# Altium schematic sheet 板球系统51控制板.SchDoc
size A3
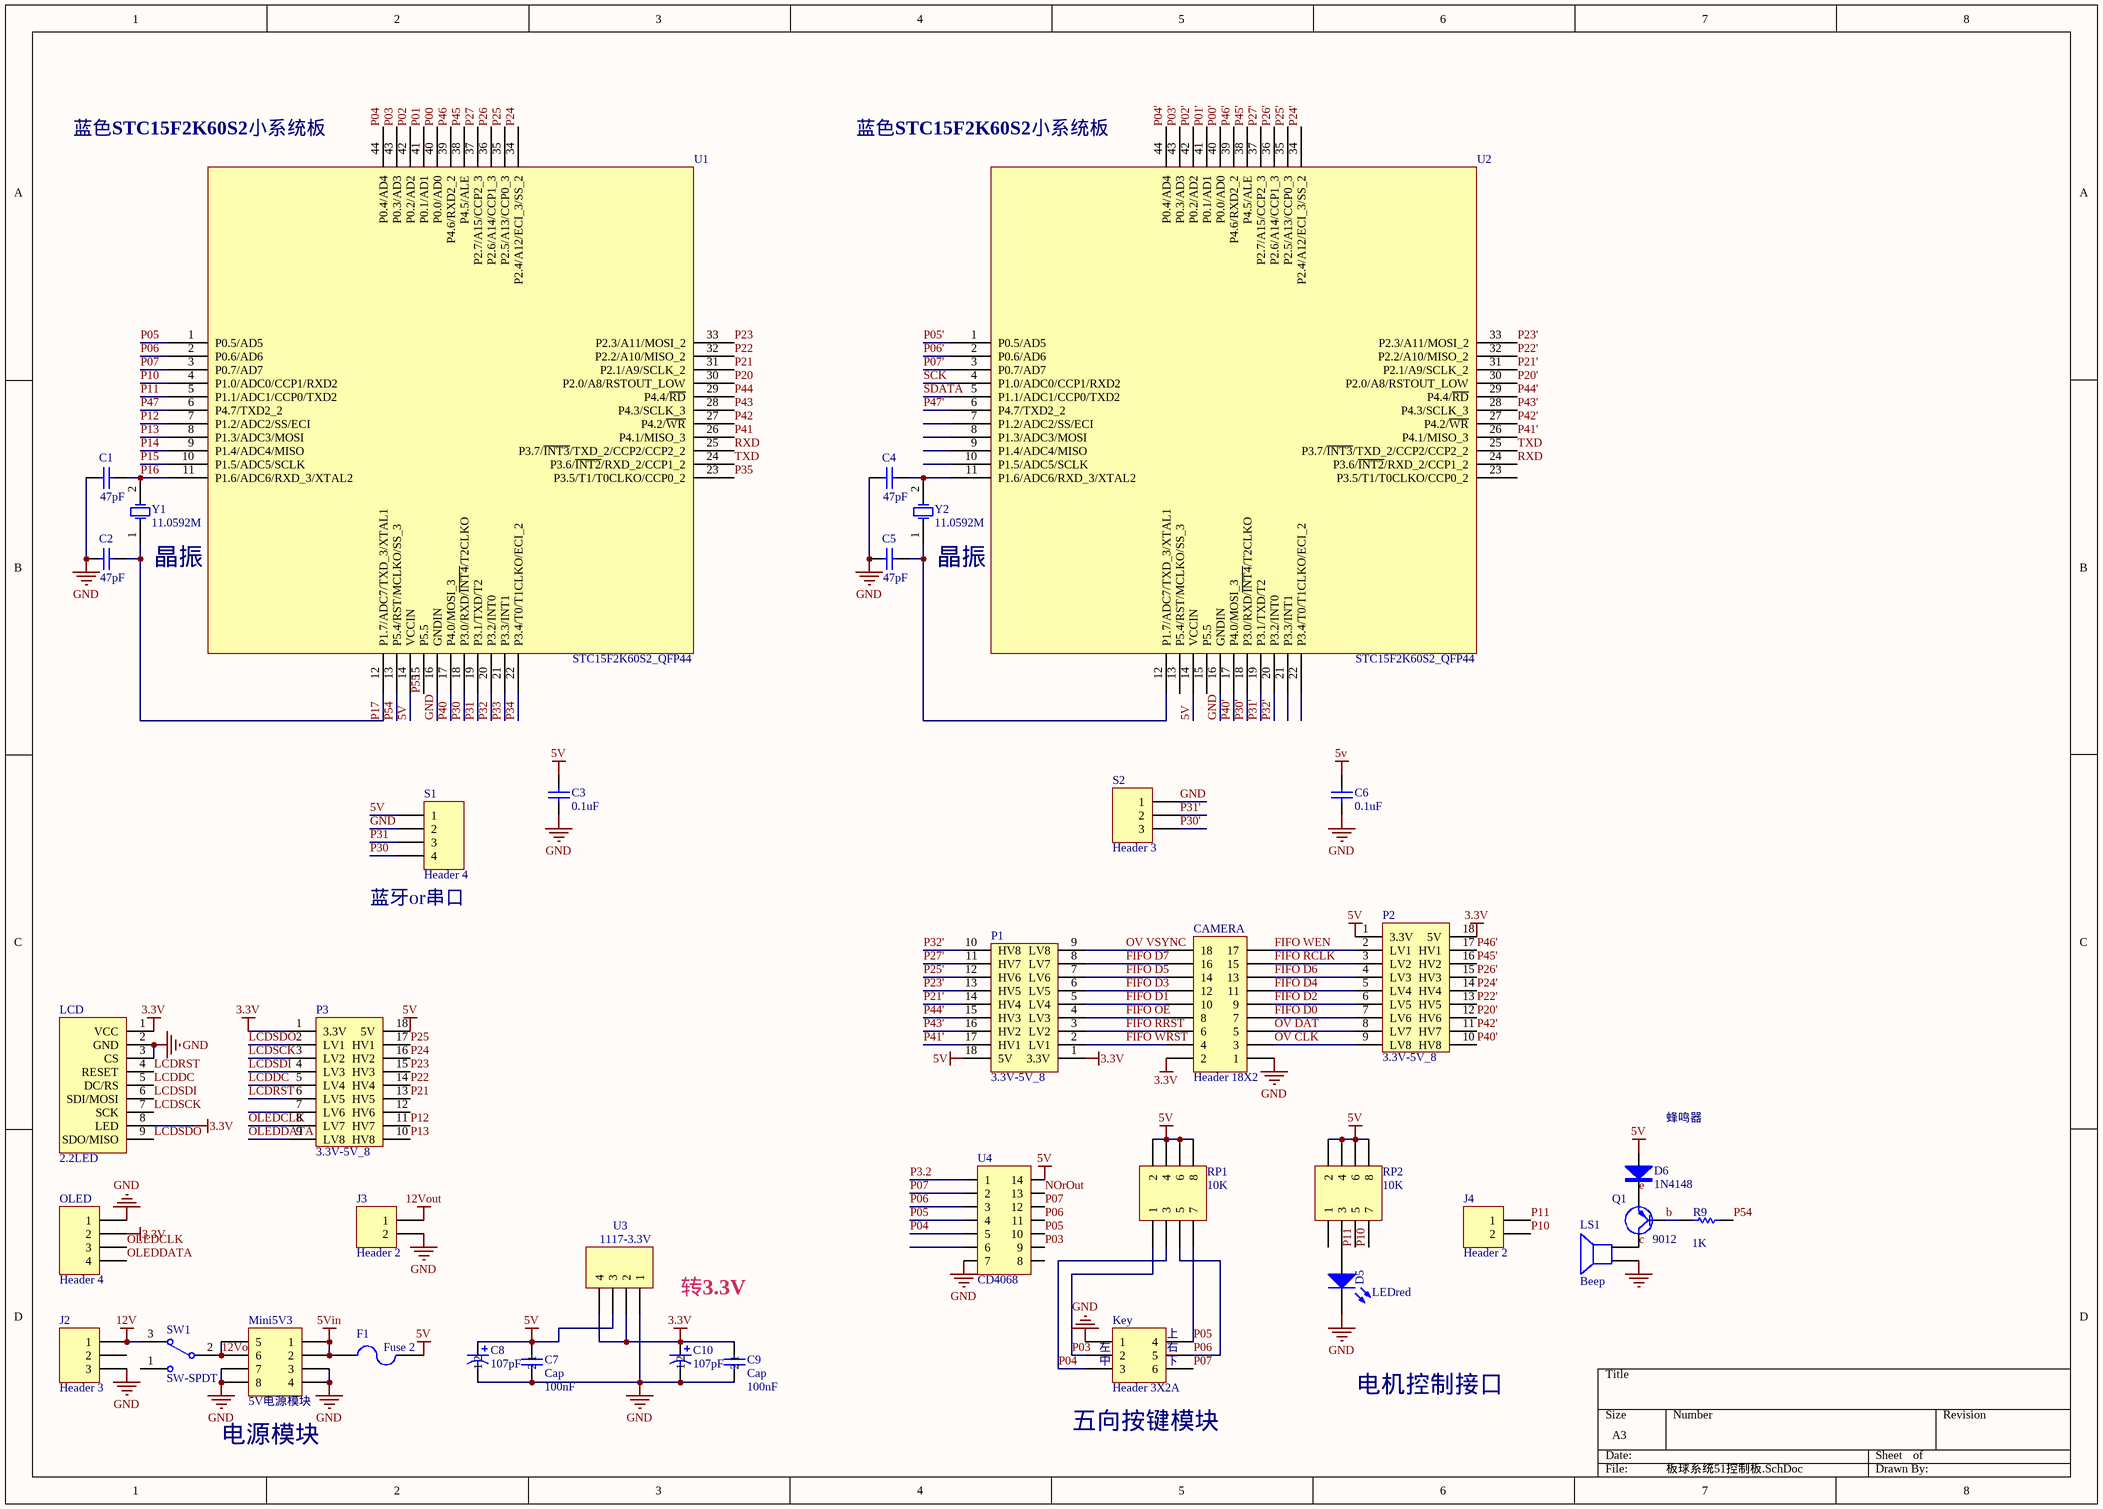
[diagram p0: 板球系统51控制板.SchDoc]

## Parts
C1  47pF  [0805]
C2  47pF  [0805]
C3  0.1uF  [0805]
C4  47pF  [0805]
C5  47pF  [0805]
C6  0.1uF  [0805]
C7  Cap  value 100nF  [0805_C]
C8  107pF  [1206]
C9  Cap  value 100nF  [0805_C]
C10  107pF  [1206]
CAMERA  Header 18X2  [HDR2X9H]
D5  LEDred  [0805_LED_S4]
D6  1N4148  [SOD-123]
F1  Fuse 2  [0805]
J2  Header 3  [Power]
J3  Header 2  [HDR1X2]
J4  Header 2  [HDR1X2]
Key  Header 3X2A  [Key5D]
LCD  2.2LED  [2.2LCD]
LS1  Beep  [BUFFER-12]
Mini5V3  5V电源模块  [Mini5Vpower]
OLED  Header 4  [sip4]
P1  3.3V-5V_8  [3.3V-5V_8]
P2  3.3V-5V_8  [3.3V-5V_8]
P3  3.3V-5V_8  [3.3V-5V_8]
Q1  9012  [SOT23]
R9  value 1K  [0805_R]  (hidden comment: Res1)
RP1  10K  [R0603_8P4R]
RP2  10K  [R0603_8P4R]
S1  Header 4  [HDR1X4]
S2  Header 3  [HDR1X3]
SW1  SW-SPDT  [switch2]
U1  STC15F2K60S2_QFP44  [LQFP44G]
U2  STC15F2K60S2_QFP44  [LQFP44G]
U3  1117-3.3V  [SOT223]
U4  CD4068  [sop14N]
Y1  11.0592M  [XTAL1]
Y2  11.0592M  [XTAL1]

## Nets
3.3V: C9.2 C10.1 CAMERA.2 LCD.1(VCC) LCD.8(LED) OLED.2 P1.1(3.3V) P2.18(5V) P3.1(3.3V) U3.2 U3.4
5V: C3.2 C6.2 C7.2 C8.1 D6.1(A) F1.2 P1.18(5V) P2.1(3.3V) P3.18(5V) RP1.2 RP1.4 RP1.6 RP1.8 RP2.2 RP2.4 RP2.6 RP2.8 S1.1 U1.14(VCCIN) U2.14(VCCIN) U3.3 U4.14
5Vin: F1.1 Mini5V3.1 Mini5V3.2
12V: J2.1 SW1.3
12Vout: J3.1 Mini5V3.5 Mini5V3.6 SW1.2
GND: C1.1 C2.1 C3.1 C4.1 C5.1 C6.1 C7.1 C8.2 C9.1 C10.2 CAMERA.1 D5.2(K) J2.3 J3.2 Key.1 LCD.2(GND) LCD.3(CS) LS1.2 Mini5V3.3 Mini5V3.4 Mini5V3.7 Mini5V3.8 OLED.1 S1.2 S2.1 U1.16(GNDIN) U2.16(GNDIN) U3.1 U4.7
b: Q1.1(B) R9.1
c: LS1.1 Q1.3(C)
e: D6.2(K) Q1.2(E)
FIFO D0: CAMERA.7 P2.7(LV6)
FIFO D1: CAMERA.10 P1.5(LV4)
FIFO D2: CAMERA.9 P2.6(LV5)
FIFO D3: CAMERA.12 P1.6(LV5)
FIFO D4: CAMERA.11 P2.5(LV4)
FIFO D5: CAMERA.14 P1.7(LV6)
FIFO D6: CAMERA.13 P2.4(LV3)
FIFO D7: CAMERA.16 P1.8(LV7)
FIFO OE: CAMERA.8 P1.4(LV3)
FIFO RCLK: CAMERA.15 P2.3(LV2)
FIFO RRST: CAMERA.6 P1.3(LV2)
FIFO WEN: CAMERA.17 P2.2(LV1)
FIFO WRST: CAMERA.4 P1.2(LV1)
LCDDC: LCD.5(DC/RS) P3.5(LV4)
LCDRST: LCD.4(RESET) P3.6(LV5)
LCDSCK: LCD.7(SCK) P3.3(LV2)
LCDSDI: LCD.6(SDI/MOSI) P3.4(LV3)
LCDSDO: LCD.9(SDO/MISO) P3.2(LV1)
NOrOut: U4.13
OLEDCLK: OLED.3 P3.8(LV7)
OLEDDATA: OLED.4 P3.9(LV8)
OV CLK: CAMERA.3 P2.9(LV8)
OV DAT: CAMERA.5 P2.8(LV7)
OV VSYNC: CAMERA.18 P1.9(LV8)
P00: U1.40(P0.0/AD0)
P00': U2.40(P0.0/AD0)
P01: U1.41(P0.1/AD1)
P01': U2.41(P0.1/AD1)
P02: U1.42(P0.2/AD2)
P02': U2.42(P0.2/AD2)
P03: Key.2 RP1.1 U1.43(P0.3/AD3) U4.9
P03': U2.43(P0.3/AD3)
P3.2: U4.1
P04: Key.3 RP1.3 U1.44(P0.4/AD4) U4.5
P04': U2.44(P0.4/AD4)
P05: Key.4 RP1.7 U1.1(P0.5/AD5) U4.4 U4.10
P05': U2.1(P0.5/AD5)
P06: Key.5 RP1.5 U1.2(P0.6/AD6) U4.3 U4.11
P06': U2.2(P0.6/AD6)
P07: Key.6 U1.3(P0.7/AD7) U4.2 U4.12
P07': U2.3(P0.7/AD7)
P10: J4.2 RP2.7 U1.4(P1.0/ADC0/CCP1/RXD2)
P11: J4.1 RP2.5 U1.5(P1.1/ADC1/CCP0/TXD2)
P12: P3.11(HV7) U1.7(P1.2/ADC2/SS/ECI)
P13: P3.10(HV8) U1.8(P1.3/ADC3/MOSI)
P14: U1.9(P1.4/ADC4/MISO)
P15: U1.10(P1.5/ADC5/SCLK)
P16: C1.2 U1.11(P1.6/ADC6/RXD_3/XTAL2) Y1.2(OSC2)
P17: C2.2 U1.12(P1.7/ADC7/TXD_3/XTAL1) Y1.1(OSC1)
P20: U1.30(P2.0/A8/RSTOUT_LOW)
P20': P2.12(HV6) U2.30(P2.0/A8/RSTOUT_LOW)
P21: P3.13(HV5) U1.31(P2.1/A9/SCLK_2)
P21': P1.14(HV4) U2.31(P2.1/A9/SCLK_2)
P22: P3.14(HV4) U1.32(P2.2/A10/MISO_2)
P22': P2.13(HV5) U2.32(P2.2/A10/MISO_2)
P23: P3.15(HV3) U1.33(P2.3/A11/MOSI_2)
P23': P1.13(HV5) U2.33(P2.3/A11/MOSI_2)
P24: P3.16(HV2) U1.34(P2.4/A12/ECI_3/SS_2)
P24': P2.14(HV4) U2.34(P2.4/A12/ECI_3/SS_2)
P25: P3.17(HV1) U1.35(P2.5/A13/CCP0_3)
P25': P1.12(HV6) U2.35(P2.5/A13/CCP0_3)
P26: U1.36(P2.6/A14/CCP1_3)
P26': P2.15(HV3) U2.36(P2.6/A14/CCP1_3)
P27: U1.37(P2.7/A15/CCP2_3)
P27': P1.11(HV7) U2.37(P2.7/A15/CCP2_3)
P30: S1.4 U1.18(P3.0/RXD/~{INT4}/T2CLKO)
P30': S2.3 U2.18(P3.0/RXD/~{INT4}/T2CLKO)
P31: S1.3 U1.19(P3.1/TXD/T2)
P31': S2.2 U2.19(P3.1/TXD/T2)
P32: U1.20(P3.2/INT0)
P32': P1.10(HV8) U2.20(P3.2/INT0)
P33: U1.21(P3.3/INT1)
P34: U1.22(P3.4/T0/T1CLKO/ECI_2)
P35: U1.23(P3.5/T1/T0CLKO/CCP0_2)
P40: U1.17(P4.0/MOSI_3)
P40': P2.10(HV8) U2.17(P4.0/MOSI_3)
P41: U1.26(P4.1/MISO_3)
P41': P1.17(HV1) U2.26(P4.1/MISO_3)
P42: U1.27(P4.2/~{WR})
P42': P2.11(HV7) U2.27(P4.2/~{WR})
P43: U1.28(P4.3/SCLK_3)
P43': P1.16(HV2) U2.28(P4.3/SCLK_3)
P44: U1.29(P4.4/~{RD})
P44': P1.15(HV3) U2.29(P4.4/~{RD})
P45: U1.38(P4.5/ALE)
P45': P2.16(HV2) U2.38(P4.5/ALE)
P46: U1.39(P4.6/RXD2_2)
P46': P2.17(HV1) U2.39(P4.6/RXD2_2)
P47: U1.6(P4.7/TXD2_2)
P47': U2.6(P4.7/TXD2_2)
P54: R9.2 U1.13(P5.4/RST/MCLKO/SS_3)
P55: U1.15(P5.5)
RXD: U1.25(P3.7/~{INT3}/TXD_2/CCP2/CCP2_2) U2.24(P3.6/~{INT2}/RXD_2/CCP1_2)
SCK: U2.4(P1.0/ADC0/CCP1/RXD2)
SDATA: U2.5(P1.1/ADC1/CCP0/TXD2)
TXD: U1.24(P3.6/~{INT2}/RXD_2/CCP1_2) U2.25(P3.7/~{INT3}/TXD_2/CCP2/CCP2_2)
NetC4_2: C4.2 U2.11(P1.6/ADC6/RXD_3/XTAL2) Y2.2(OSC2)
NetC5_2: C5.2 U2.12(P1.7/ADC7/TXD_3/XTAL1) Y2.1(OSC1)
NetD5_1: D5.1(A) RP2.3

Not connected (* = marked no-connect by the designer): J2 2; P3 7(LV6) 12(HV6); RP2 1; SW1 1; U2 7(P1.2/ADC2/SS/ECI) 8(P1.3/ADC3/MOSI) 9(P1.4/ADC4/MISO) 10(P1.5/ADC5/SCLK) 13(P5.4/RST/MCLKO/SS_3) 15(P5.5) 21(P3.3/INT1) 22(P3.4/T0/T1CLKO/ECI_2) 23(P3.5/T1/T0CLKO/CCP0_2); U4 6 8

## Notes on the sheet
- (near U1) 蓝色STC15F2K60S2小系统板
- (near U2) 蓝色STC15F2K60S2小系统板
- 晶振
- (near S1) 蓝牙or串口
- (near D6) 蜂鸣器
- 转3.3V
- (near Key) 左
- (near Key) 中
- (near Key) 上
- (near Key) 右
- (near Key) 下
- 电机控制接口
- 电源模块
- (near Key) 五向按键模块

## Library data of the parts
C1-C7 C9 = Cap: Capacitor; Published: 8-Jun-2000; LatestRevisionDate: 17-Jul-2002; LatestRevisionNote: Re-released for DXP Platform.; PackageReference: RAD-0.3; Publisher: Altium Limited
  C1 C2 C4 C5: Value: 47pF
  C3 C6: Value: 0.1uF
C8 C10 = Cap Pol1: Polarized Capacitor (Radial); Published: 8-Jun-2000; LatestRevisionDate: 17-Jul-2002; LatestRevisionNote: Re-released for DXP Platform.; PackageReference: RB7.6-15; Publisher: Altium Limited; Value: 107pF
CAMERA = Header 9X2: Header, 9-Pin, Dual row; LatestRevisionDate: 17-Jul-2002; LatestRevisionNote: Re-released for DXP Platform.; Publisher: Altium Limited
D5 = LED0: Typical INFRARED GaAs LED; Published: 8-Jun-2000; LatestRevisionDate: 08-Jul-2005; LatestRevisionNote: Mech Layer 1 removed.; PackageReference: LED-0; Publisher: Altium Limited
D6 = 1N4148: Diode
F1 = Fuse 2: Fuse; Published: 8-Jun-2000; LatestRevisionDate: 17-Jul-2002; LatestRevisionNote: Re-released for DXP Platform.; PackageReference: PIN-W2/E2.8; Publisher: Altium Limited
J2 S2 = Header 3: Header, 3-Pin; LatestRevisionDate: 17-Jul-2002; LatestRevisionNote: Re-released for DXP Platform.; Publisher: Altium Limited
J3 J4 = Header 2: Header, 2-Pin; LatestRevisionDate: 17-Jul-2002; LatestRevisionNote: Re-released for DXP Platform.; Publisher: Altium Limited
Key = Header 3X2A: Header, 3-Pin, Dual row; LatestRevisionDate: 17-Jul-2002; LatestRevisionNote: Re-released for DXP Platform.; Publisher: Altium Limited
LS1 = SPEAKER
Mini5V3 = Header 4X2A: Header, 4-Pin, Dual row; LatestRevisionDate: 17-Jul-2002; LatestRevisionNote: Re-released for DXP Platform.; Publisher: Altium Limited
OLED S1 U3 = Header 4: Header, 4-Pin; LatestRevisionDate: 17-Jul-2002; LatestRevisionNote: Re-released for DXP Platform.; Publisher: Altium Limited
R9 = Res1: Resistor; Published: 8-Jun-2000; LatestRevisionDate: 17-Jul-2002; LatestRevisionNote: Re-released for DXP Platform.; PackageReference: AXIAL-0.3; Publisher: Altium Limited
RP1 RP2 = Header 4X2: Header, 4-Pin, Dual row; LatestRevisionDate: 17-Jul-2002; LatestRevisionNote: Re-released for DXP Platform.; Publisher: Altium Limited
SW1 = SW-SPDT: SPDT Subminiature Toggle Switch, Right Angle Mounting, Vertical Actuation; Published: 24-Mar-1999; LatestRevisionDate: 17-Dec-2003; LatestRevisionNote: Schematic revised, PCB Footprint replaced.; DatasheetDocument: 05-Dec-2000; PackageReference: TL36WW15050; Publisher: Altium Limited; ComponentLink1Description: Manufacturer Link; ComponentLink1URL: http://www.apem.com
Y1 Y2 = XTAL: Crystal Oscillator; Published: 8-Jun-2000; LatestRevisionDate: 17-Jul-2002; LatestRevisionNote: Re-released for DXP Platform.; PackageReference: R38; Publisher: Altium Limited